# Altium schematic sheet Slave_Button.SchDoc
size Legal
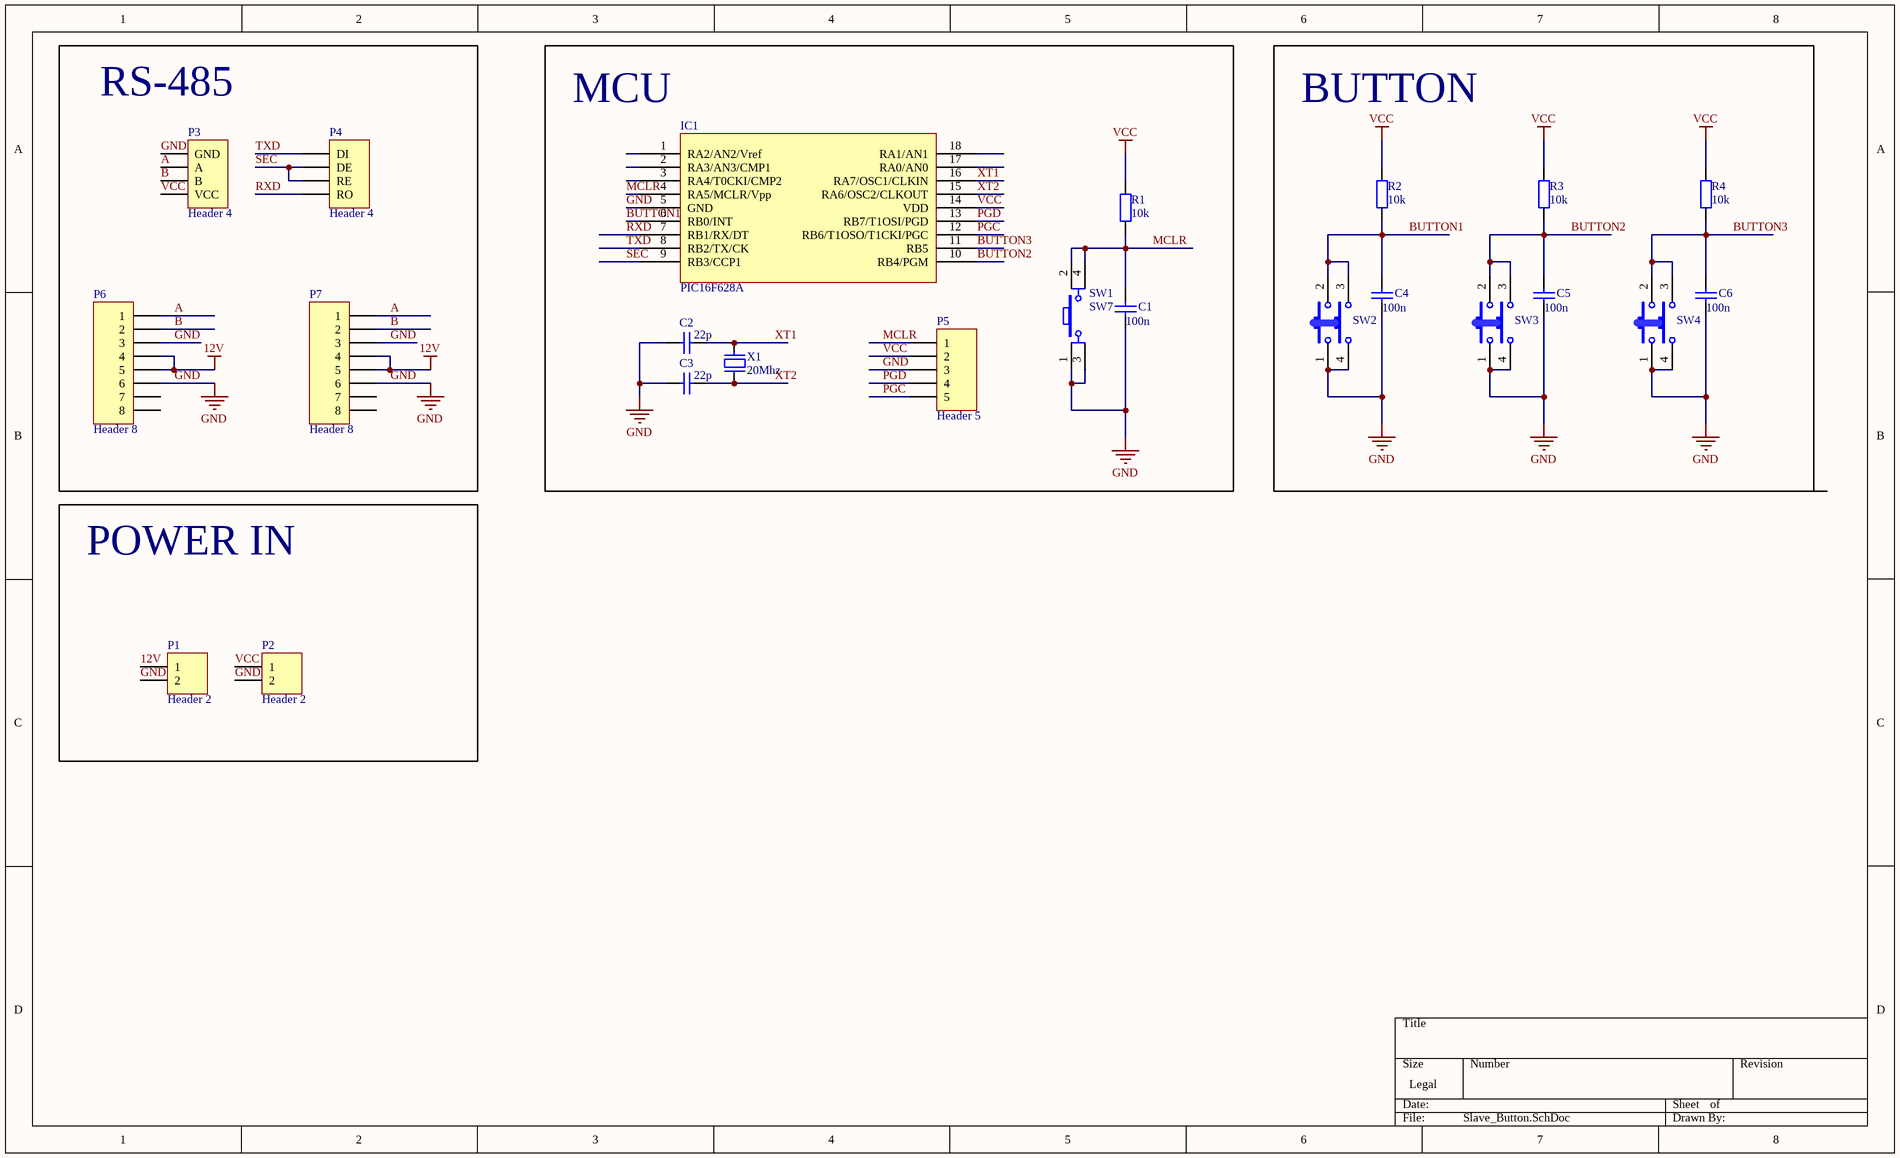
[diagram p0: Slave_Button.SchDoc]

## Parts
C1  value 100n  [Cap Non-Pol 3mm]  (hidden comment: Capacitor Ceramic)
C2  value 22p  [Cap Non-Pol 3mm]  (hidden comment: Cap Non-pol)
C3  value 22p  [Cap Non-Pol 3mm]  (hidden comment: Cap Non-pol)
C4  value 100n  [Cap Non-Pol 3mm]  (hidden comment: Capacitor Ceramic)
C5  value 100n  [Cap Non-Pol 3mm]  (hidden comment: Capacitor Ceramic)
C6  value 100n  [Cap Non-Pol 3mm]  (hidden comment: Capacitor Ceramic)
IC1  PIC16F628A  [DIP18/W0.3]
P1  Header 2  [HDR1X2]
P2  Header 2  [HDR1X2]
P3  Header 4  [HDR1X4]
P4  Header 4  [HDR1X4]
P5  Header 5  [Header 5]
P6  Header 8  [RJ11]
P7  Header 8  [RJ11]
R1  value 10k  [RESISTOR 1/4W]  (hidden comment: RES_SMD_0805)
R2  value 10k  [RESISTOR 1/4W]  (hidden comment: RES_SMD_0805)
R3  value 10k  [RESISTOR 1/4W]  (hidden comment: RES_SMD_0805)
R4  value 10k  [RESISTOR 1/4W]  (hidden comment: RES_SMD_0805)
SW1  SW7  [SW4]
SW2  SW-4P-B  [SW4]  (value not drawn)
SW3  SW-4P-B  [SW4]  (value not drawn)
SW4  SW-4P-B  [SW4]  (value not drawn)
X1  20Mhz  [XT2]

## Blocks framed on the sheet
RS-485: P3 P4 P6 P7
MCU: C1-C3 IC1 P5 R1 SW1 X1
POWER IN: P1 P2

## Nets
12V: P1.1 P6.4 P6.5 P7.4 P7.5
GND: C1.1 C2.2 C3.2 C4.1 C5.1 C6.1 IC1.5(GND) P1.2 P2.2 P3.1(GND) P5.3 P6.3 P6.6 P7.3 P7.6 SW1.1 SW1.3 SW2.1 SW2.4 SW3.1 SW3.4 SW4.1 SW4.4
VCC: IC1.14(VDD) P2.1 P3.4(VCC) P5.2 R1.2 R2.2 R3.2 R4.2
A: P3.2(A) P6.1 P7.1
B: P3.3(B) P6.2 P7.2
BUTTON1: C4.2 IC1.6(RB0/INT) R2.1 SW2.2 SW2.3
BUTTON2: C5.2 IC1.10(RB4/PGM) R3.1 SW3.2 SW3.3
BUTTON3: C6.2 IC1.11(RB5) R4.1 SW4.2 SW4.3
MCLR: C1.2 IC1.4(RA5/MCLR/Vpp) P5.1 R1.1 SW1.2 SW1.4
PGC: IC1.12(RB6/T1OSO/T1CKI/PGC) P5.5
PGD: IC1.13(RB7/T1OSI/PGD) P5.4
RXD: IC1.7(RB1/RX/DT) P4.4(RO)
SEC: IC1.9(RB3/CCP1) P4.2(DE) P4.3(RE)
TXD: IC1.8(RB2/TX/CK) P4.1(DI)
XT1: C2.1 IC1.16(RA7/OSC1/CLKIN) X1.2
XT2: C3.1 IC1.15(RA6/OSC2/CLKOUT) X1.1

Not connected (* = marked no-connect by the designer): IC1 1(RA2/AN2/Vref) 2(RA3/AN3/CMP1) 3(RA4/T0CKI/CMP2) 17(RA0/AN0) 18(RA1/AN1); P6 7 8; P7 7 8

## Notes on the sheet
- BUTTON

## Library data of the parts
C1 C4-C6 = CapSMD: Capacitor; Published: 8-Jun-2000; LatestRevisionDate: 17-Jul-2002; LatestRevisionNote: Re-released for DXP Platform.; PackageReference: RAD-0.3; Publisher: Altium Limited
C2 C3 = Cap Non-pol: Non-polarized Capacitor; Published: 8-Jun-2000; LatestRevisionDate: 17-Jul-2002; LatestRevisionNote: Re-released for DXP Platform.; PackageReference: RAD-0.3; Publisher: Altium Limited
P1 P2 = Header 2: Header, 2-Pin; LatestRevisionDate: 17-Jul-2002; LatestRevisionNote: Re-released for DXP Platform.; Publisher: Altium Limited
P3 P4 = Header 4: Header, 4-Pin; LatestRevisionDate: 17-Jul-2002; LatestRevisionNote: Re-released for DXP Platform.; Publisher: Altium Limited
P5 = Header 5: Header, 5-Pin; LatestRevisionDate: 17-Jul-2002; LatestRevisionNote: Re-released for DXP Platform.; Publisher: Altium Limited
P6 P7 = Header 8: Header, 8-Pin; LatestRevisionDate: 17-Jul-2002; LatestRevisionNote: Re-released for DXP Platform.; Publisher: Altium Limited
R1-R4 = RES_SMD_0805: RES_0805; Published: 8-Jun-2000; LatestRevisionDate: 17-Jul-2002; LatestRevisionNote: Re-released for DXP Platform.; PackageReference: AXIAL-0.4; Publisher: Altium Limited
SW1 = SW4: Switch button 4 pin; Value: Button chip 4 pin
SW2-SW4 = SW-4PIN-BIG: Switch Big 4 Pin; Published: 24-Mar-1999; LatestRevisionDate: 17-Jul-2002; LatestRevisionNote: Re-released for DXP Platform.; PackageReference: SPST-2; Publisher: Altium Limited
X1 = XT2: Crystal For all Crystal 2pin.; Value: 4Mhz